# Altium schematic sheet X-13 NOTE.SchDoc
size 513 x 386 mm; Address1: 350W 9th Ave; Address2: Suite 206; Address3: Escondido CA 92025; Address4: United States; Revision: -; ENG_APP_DATE: --/--/--; DSN_APP_DATE: --/--/--; CHK_APP_DATE: --/--/--
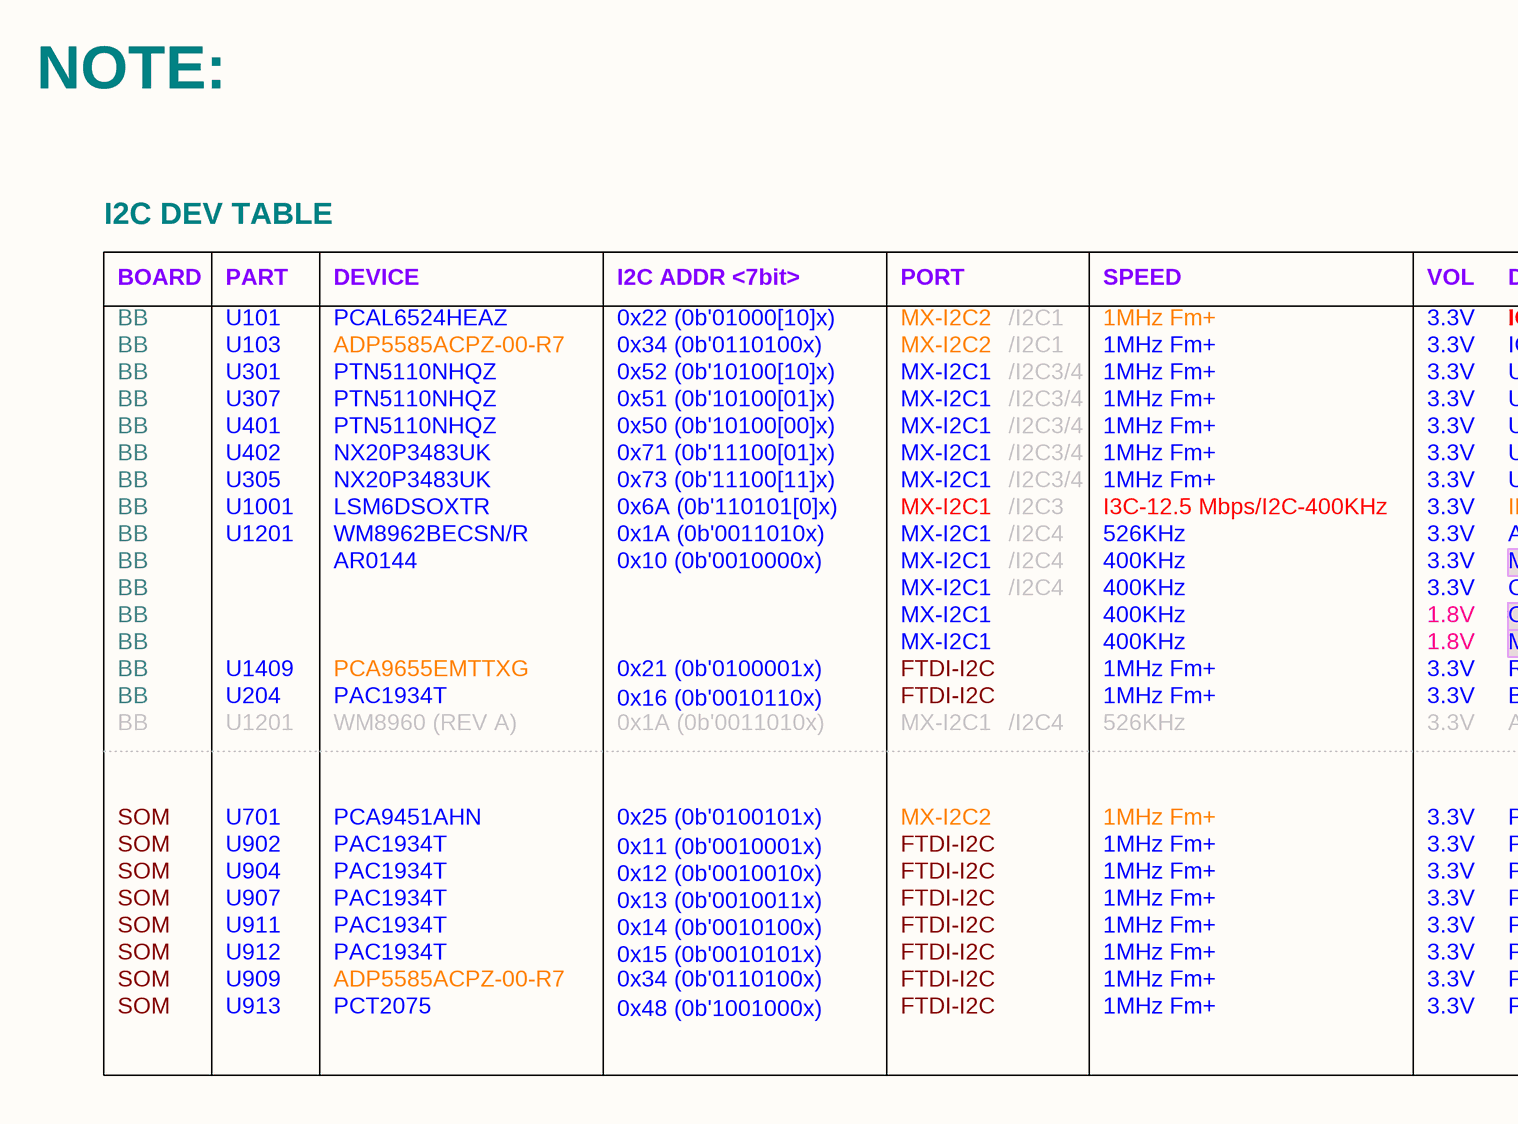
[diagram p0: X-13 NOTE.SchDoc, left]
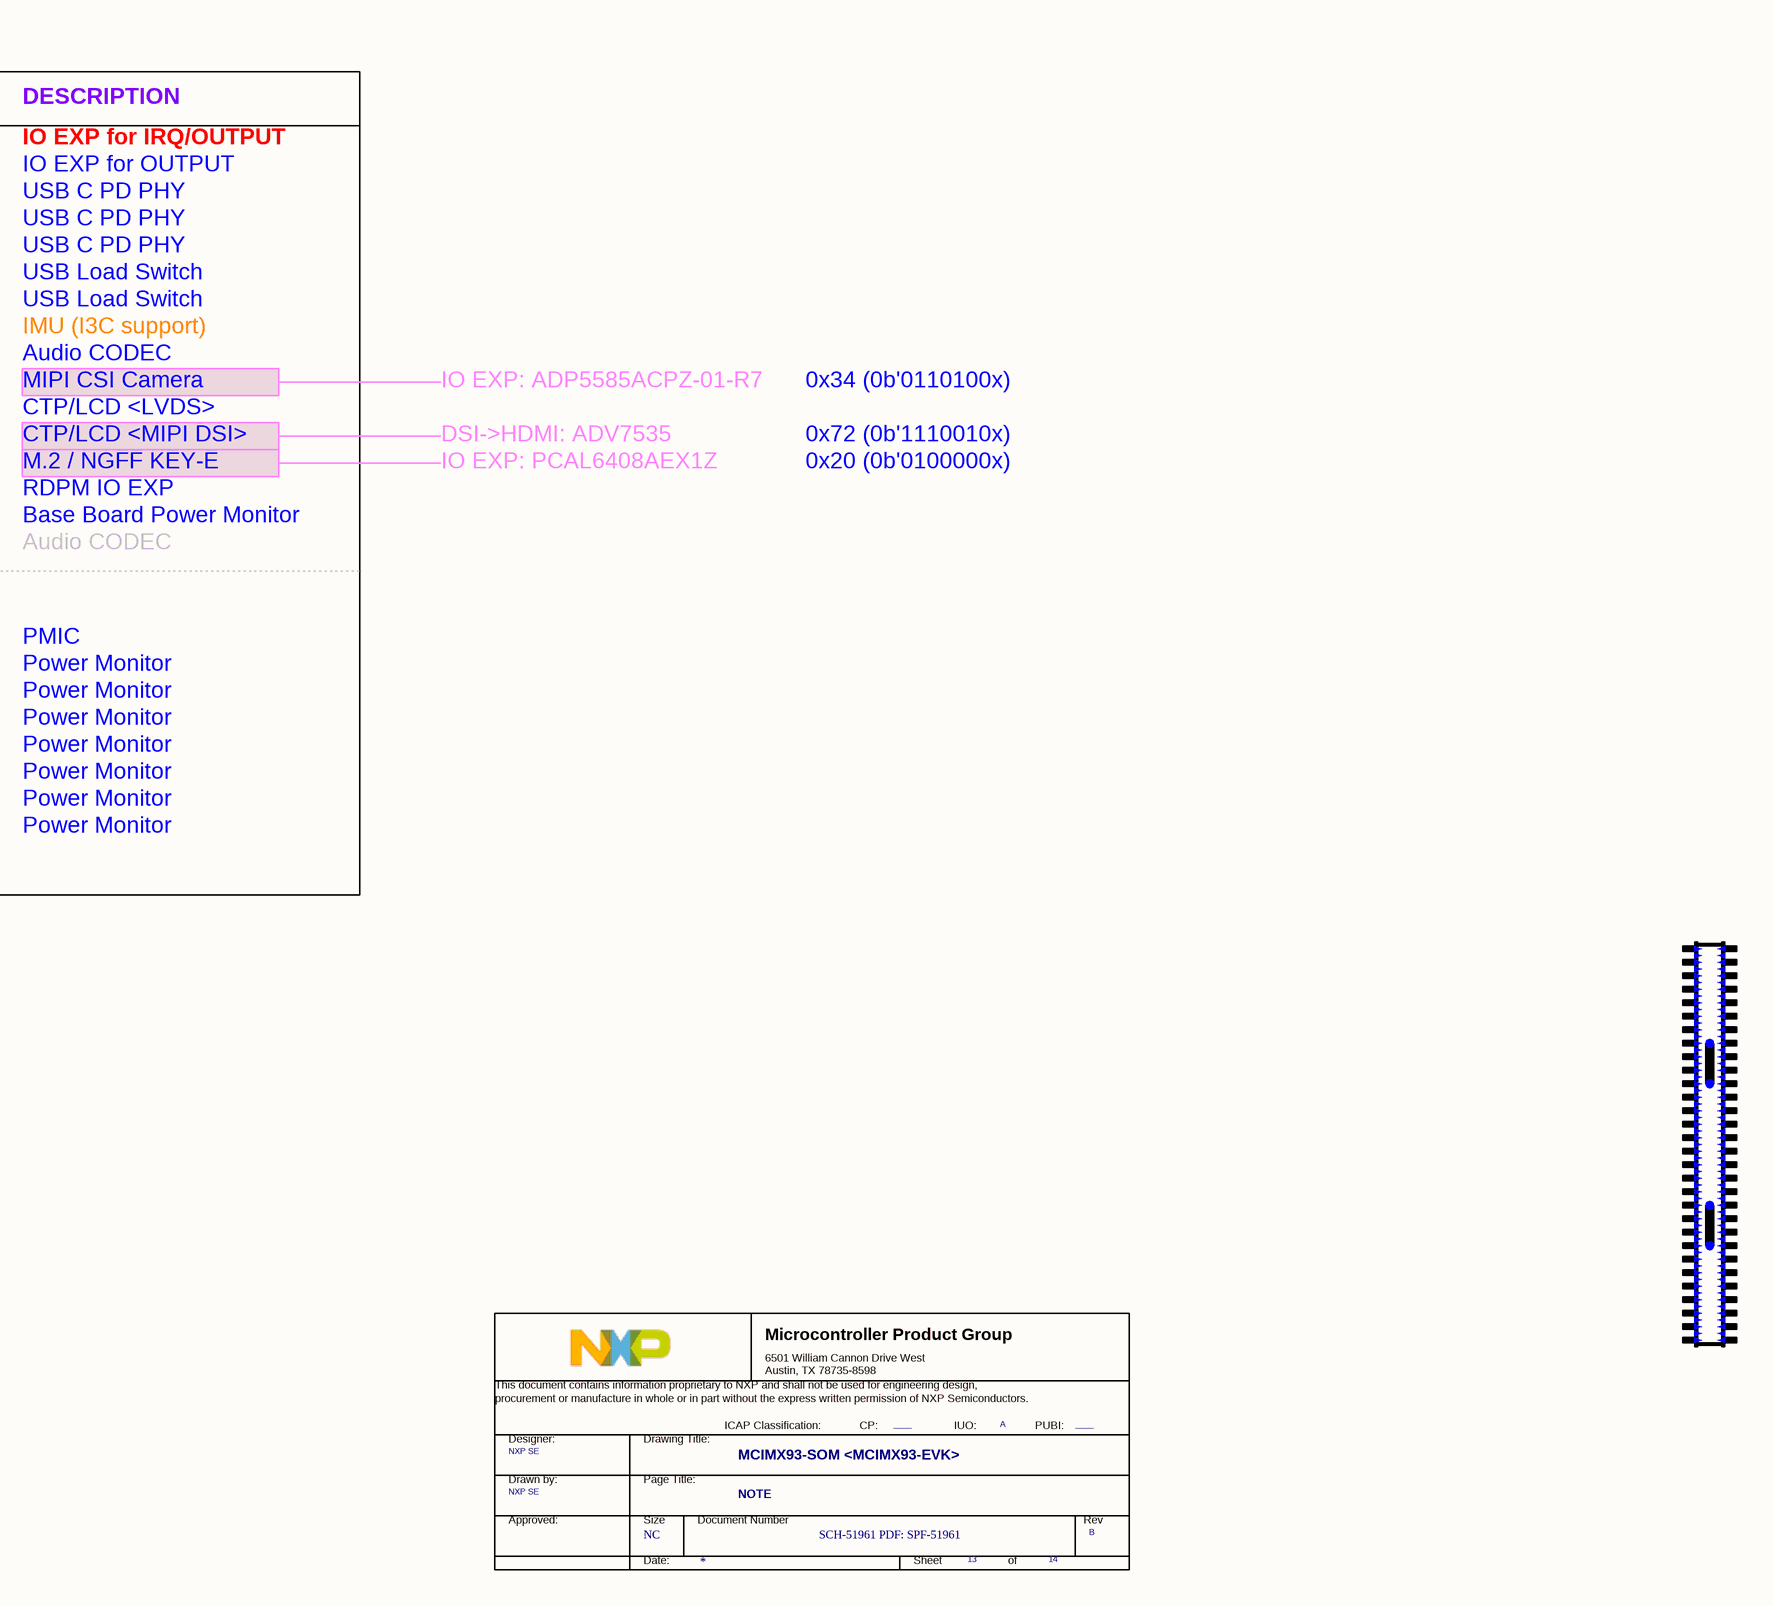
[diagram p1: X-13 NOTE.SchDoc, right]

## Parts
*  Doc: SCH-51961 PDF: SPF-51961  RevCode: B  Title: MCIMX93-SOM <MCIMX93-EVK>  Page Size: NC  Page Number: 13  Page Count: 14  PageTitle: NOTE  Designer: NXP SE  PUBI: ____  FIUO: A  (hidden comment: TitleBlock_MCPG)  (graphical)

## Notes on the sheet
- NOTE:
- I2C DEV TABLE
- BOARD
- PART
- DEVICE
- I2C ADDR <7bit>
- PORT
- SPEED
- VOL
- DESCRIPTION
- BB
- U103
- U101
- ADP5585ACPZ-00-R7
- PCAL6524HEAZ
- 0x22 (0b'01000[10]x)
- 0x34 (0b'0110100x)
- MX-I2C2
- /I2C1
- 1MHz Fm+
- 3.3V
- IO EXP for OUTPUT
- IO EXP for IRQ/OUTPUT
- U307
- U301
- U401
- PTN5110NHQZ
- 0x52 (0b'10100[10]x)
- 0x50 (0b'10100[00]x)
- 0x51 (0b'10100[01]x)
- MX-I2C1
- /I2C3/4
- USB C PD PHY
- U402
- U305
- NX20P3483UK
- 0x73 (0b'11100[11]x)
- 0x71 (0b'11100[01]x)
- USB Load Switch
- U1001
- U1201
- WM8962BECSN/R
- LSM6DSOXTR
- AR0144
- 0x10 (0b'0010000x)
- 0x6A (0b'110101[0]x)
- 0x1A (0b'0011010x)
- /I2C4
- /I2C3
- 400KHz
- I3C-12.5 Mbps/I2C-400KHz
- 526KHz
- IMU (I3C support)
- MIPI CSI Camera
- Audio CODEC
- IO EXP: ADP5585ACPZ-01-R7
- 1.8V
- CTP/LCD <MIPI DSI>
- CTP/LCD <LVDS>
- DSI->HDMI: ADV7535
- 0x72 (0b'1110010x)
- U204
- U1409
- PAC1934T
- PCA9655EMTTXG
- 0x16 (0b'0010110x)
- 0x21 (0b'0100001x)
- FTDI-I2C
- Base Board Power Monitor
- RDPM IO EXP
- M.2 / NGFF KEY-E
- IO EXP: PCAL6408AEX1Z
- 0x20 (0b'0100000x)
- WM8960 (REV A)
- SOM
- U701
- PCA9451AHN
- 0x25 (0b'0100101x)
- PMIC
- U902
- U904
- U907
- 0x11 (0b'0010001x)
- 0x13 (0b'0010011x)
- 0x12 (0b'0010010x)
- Power Monitor
- U911
- U912
- 0x15 (0b'0010101x)
- 0x14 (0b'0010100x)
- U909
- U913
- PCT2075
- 0x48 (0b'1001000x)
- 8
- 7
- 6
- 5
- 4
- 3
- 2
- 1
- REVISION
- DATE
- APPROVED
- F
- E
- D
- C
- B
- PROJECT:
- REV.
- ENG:
- APPROVALS
- PROJECT
- JordanDSP LLC <https://www.jordandsp.com>
- Envision Excellence
- SHT.
- A
- DSN:
- CHK:
- REFERENCE ITEMS
- PRJ VCS REVISION:
- TITLE
- DOC VCS REVISION:
- MODIFIED DATE:
- BOM:
- FAB DWG:
- FIRMWARE:
- ASSY DWG:
- SCALE:
- SIZE
- CAGE CODE
- FILE NAME
- DWG NO.
- PAGE
- PRODUCT REV
- OF
- (in symbol TitleBlock_MCPG) Microcontroller Product Group; 6501 William Cannon Drive West / Austin, TX 78735-8598; This document contains information proprietary to NXP and shall not be used for engineering design,; procurement or manufacture in whole or in part without the express written permission of NXP Semiconductors.; ICAP Classification:; CP:; IUO:; PUBI:; Designer:; Drawing Title:; Drawn by:; Page Title:; Approved:; Size; Document Number; Rev; Date:; Sheet; of

## Library data of the parts
* = TitleBlock_MCPG: OrgName: NXP Semiconductor; OrgAddr1: NO. 192 Liangjing Rd. Pudong New Area, ShangHai; Page Create Date: March  8, 1995; DrawnBy: NXP SE; FCP: ____; Page Modify Date: *